# EAGLE schematic Skematik Majes (EAGLE 9.6.2)
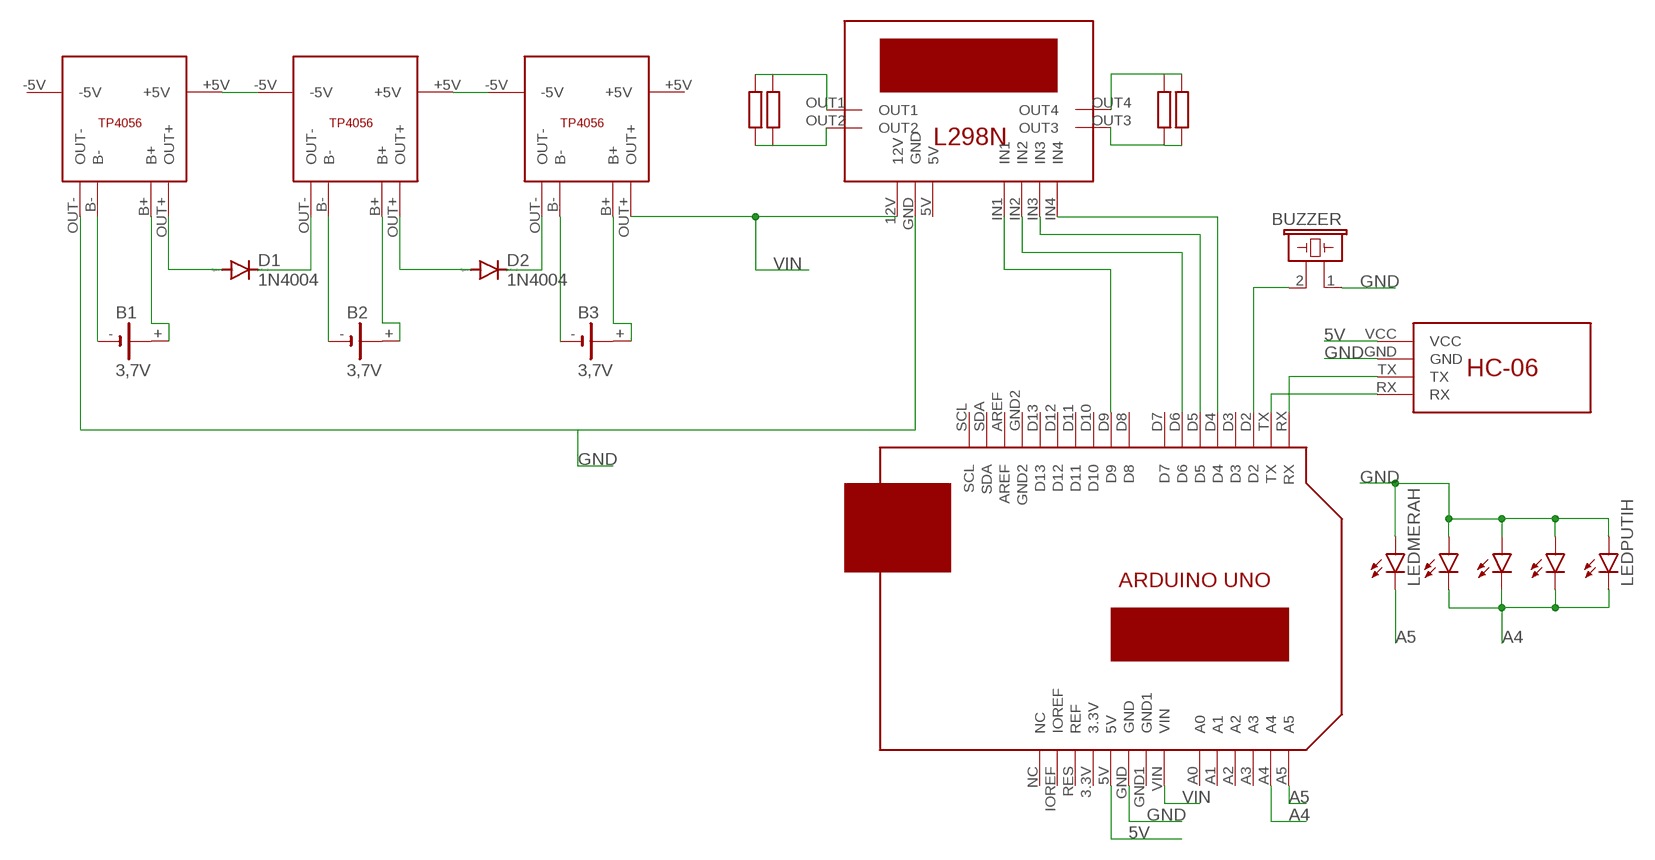
[diagram p0: schematic, sheet 1]

## Parts
B1  3,7V  CRAA  [CRAA]
B2  3,7V  CRAA  [CRAA]
B3  3,7V  CRAA  [CRAA]
BUZZER  B/C11L  [B/C11L]
D1  1N4004  [DO41-10]
D2  1N4004  [DO41-10]
LED1  LAW57B  [W57B]
LED2  LAW57B  [W57B]
LED3  LAW57B  [W57B]
LEDMERAH  LAW57B  [W57B]
LEDPUTIH  LAW57B  [W57B]
U$1  ARDUINOUNO  [ARDUINOUNO]
U$2  HC-06  [HC-06]
U$3  L298N  [L298N]
U$4  TP4086  [TP4056]
U$5  TP4086  [TP4056]
U$6  TP4086  [TP4056]

## Nets
5V: U$1.5V U$2.VCC
A4: LED1.C LED1.C@1(C) LED1.C@2(C) LED1.C@3(C) LED1.C@4(C) LED1.C@5(C) LED2.C LED2.C@1(C) LED2.C@2(C) LED2.C@3(C) LED2.C@4(C) LED2.C@5(C) LED3.C LED3.C@1(C) LED3.C@2(C) LED3.C@3(C) LED3.C@4(C) LED3.C@5(C) LEDPUTIH.C LEDPUTIH.C@1(C) LEDPUTIH.C@2(C) LEDPUTIH.C@3(C) LEDPUTIH.C@4(C) LEDPUTIH.C@5(C) U$1.A4
A5: LEDMERAH.C LEDMERAH.C@1(C) LEDMERAH.C@2(C) LEDMERAH.C@3(C) LEDMERAH.C@4(C) LEDMERAH.C@5(C) U$1.A5
GND: BUZZER.1 LED1.A LED2.A LED3.A LEDMERAH.A LEDPUTIH.A U$1.GND U$2.GND U$3.GND U$4.OUT-
N$1: U$4.+5V U$5.-5V
N$2: U$5.+5V U$6.-5V
N$3: D1.A U$4.OUT+
N$4: D1.C U$5.OUT-
N$5: D2.A U$5.OUT+
N$6: D2.C U$6.OUT-
N$7: B1.- U$4.B-
N$8: B1.+ U$4.B+
N$9: B2.- U$5.B-
N$10: B2.+ U$5.B+
N$11: B3.- U$6.B-
N$12: B3.+ U$6.B+
N$13: BUZZER.2 U$1.D2
N$15: U$1.D4 U$3.IN4
N$16: U$1.D5 U$3.IN3
N$17: U$1.D6 U$3.IN2
N$18: U$1.D9 U$3.IN1
N$19: U$3.OUT4
N$20: U$3.OUT3
N$21: U$3.OUT1
N$22: U$3.OUT2
N$23: U$1.RX U$2.TX
N$24: U$1.TX U$2.RX
VIN: U$1.VIN U$3.12V U$6.OUT+
Unconnected: B1.+@1(+) B2.+@1(+) B3.+@1(+) U$1.3.3V U$1.A0 U$1.A1 U$1.A2 U$1.A3 U$1.AREF U$1.D3 U$1.D7 U$1.D8 U$1.D10 U$1.D11 U$1.D12 U$1.D13 U$1.GND1 U$1.GND2 U$1.IOREF U$1.NC U$1.RES(REF) U$1.SCL U$1.SDA U$3.5V U$4.-5V U$6.+5V

## Library data of the parts
B1-B3 = battery:CRAA: LI BATTERY Varta
BUZZER = buzzer:B/C11L: BUZZER Source: Buerklin; OC_FARNELL: unknown; OC_NEWARK: unknown
D1 D2 = diode:1N4004: DIODE general purpose rectifier, 1 A
LED1-LED3 LEDMERAH LEDPUTIH = led:*W57B: Golden Dragon® 1 Watt LED Place heat sink pads of cathode with INVOKE Source: www.osram-os.com la_ly_w57b.pdf
U$1 = ESP32 DEVKIT V1:ARDUINOUNO
U$2 = ESP32 DEVKIT V1:HC-06
U$3 = ESP32 DEVKIT V1:L298N
U$4-U$6 = ESP32 DEVKIT V1:TP4086